# Altium project RMOV_chopper_ver1-0.PrjPcb (part 2 of 2)

## Sheet 02-MeasurementChannels.SchDoc
size C; DocumentNumber: 3; SheetNumber: 3; SheetTotal: 4
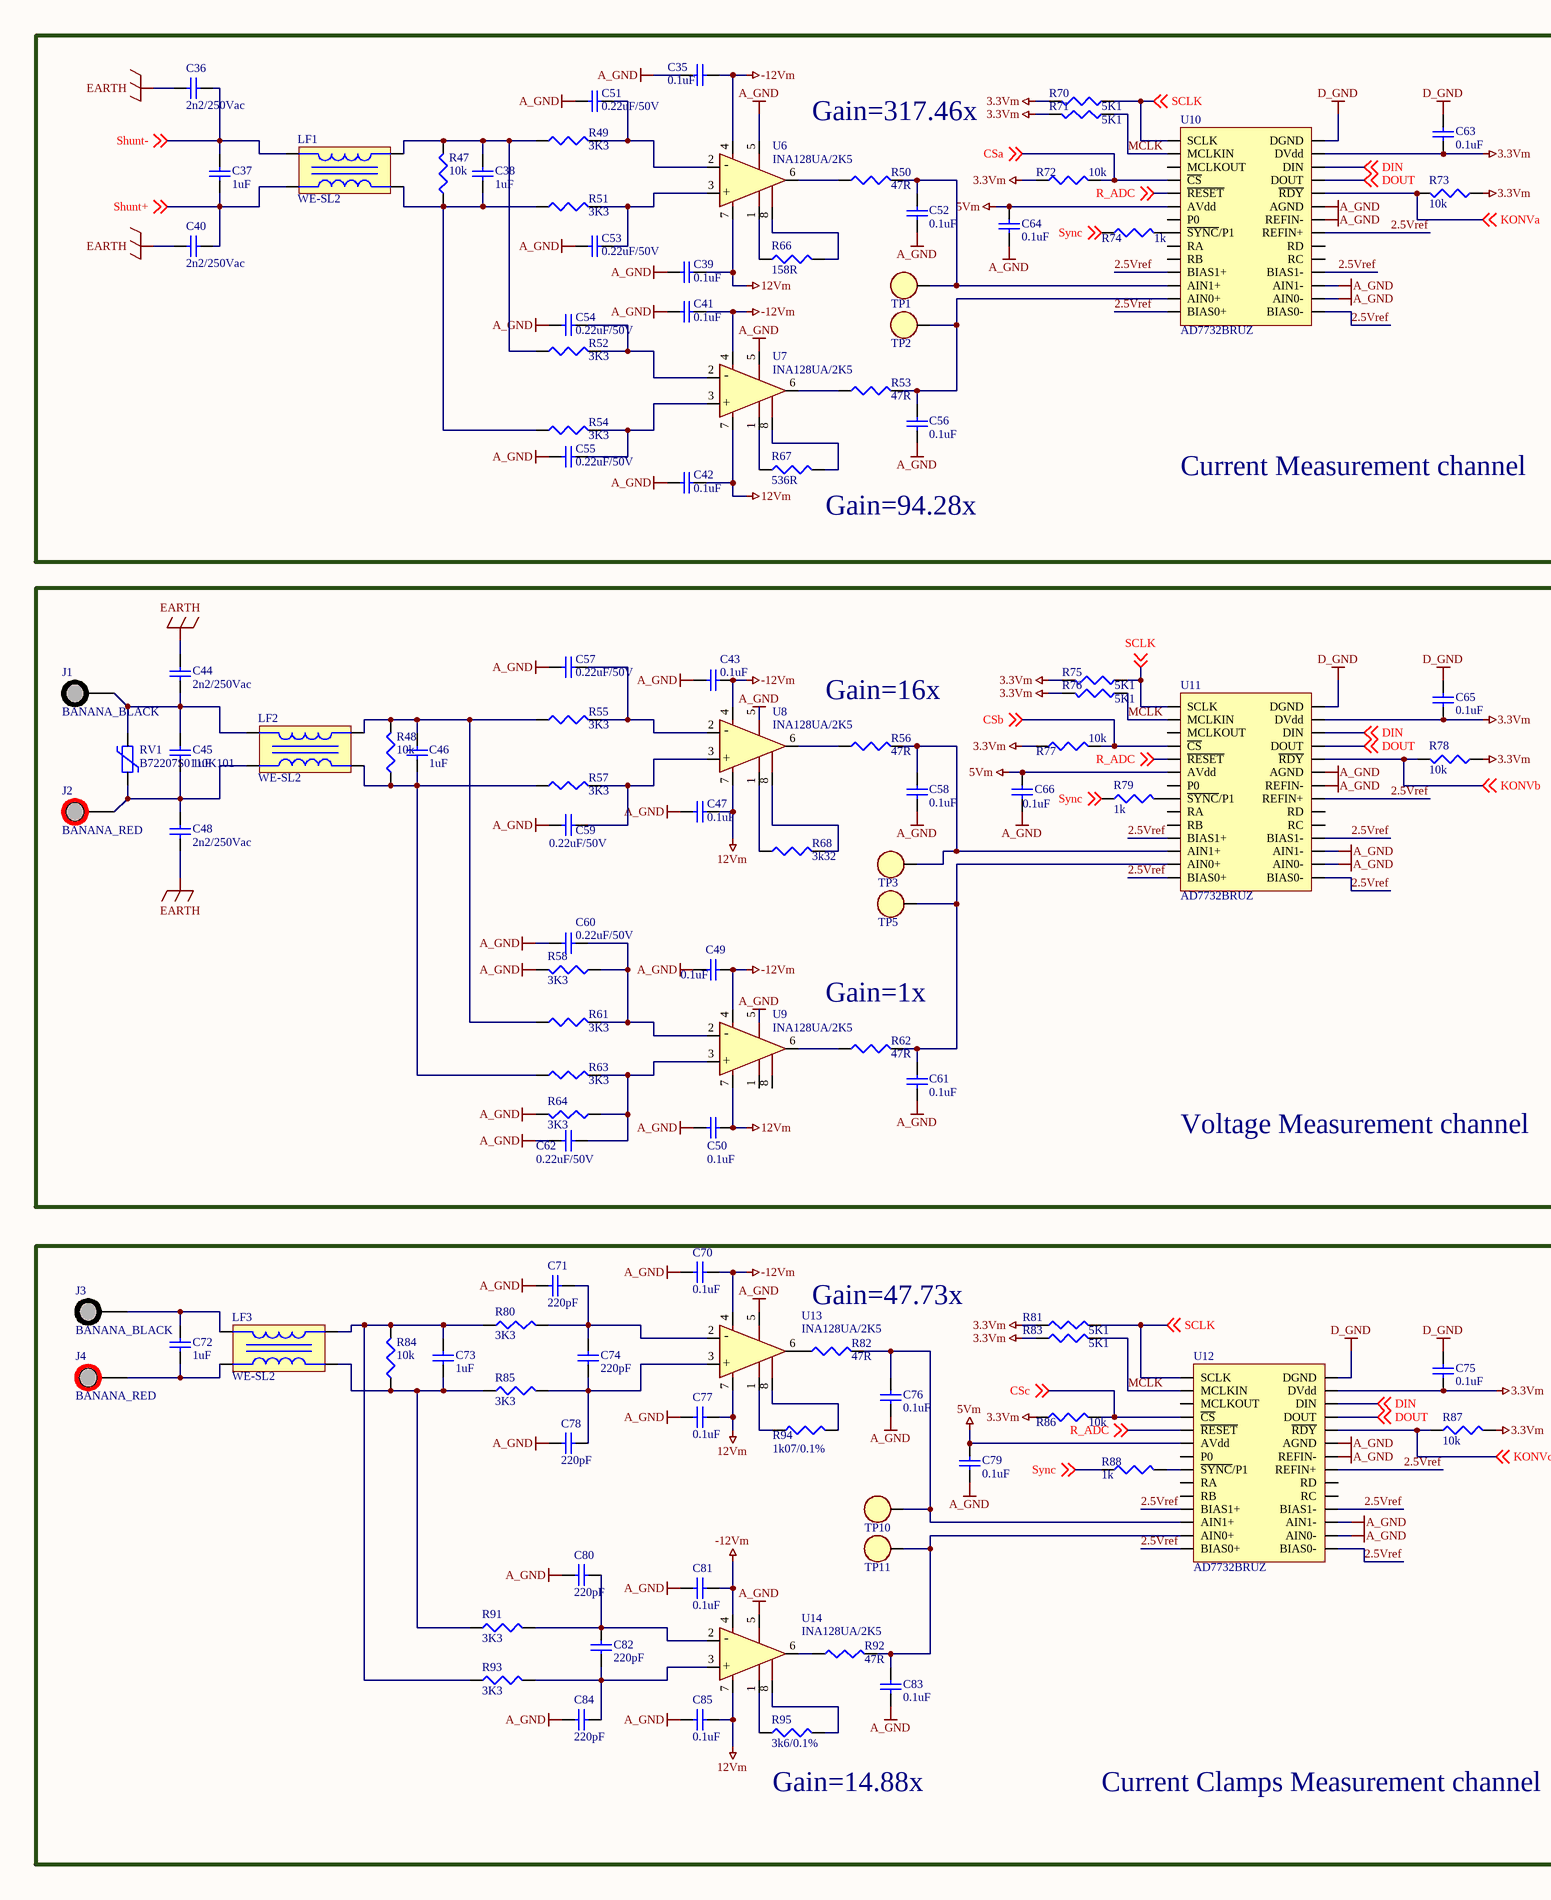
[diagram p2: 02-MeasurementChannels.SchDoc, left]
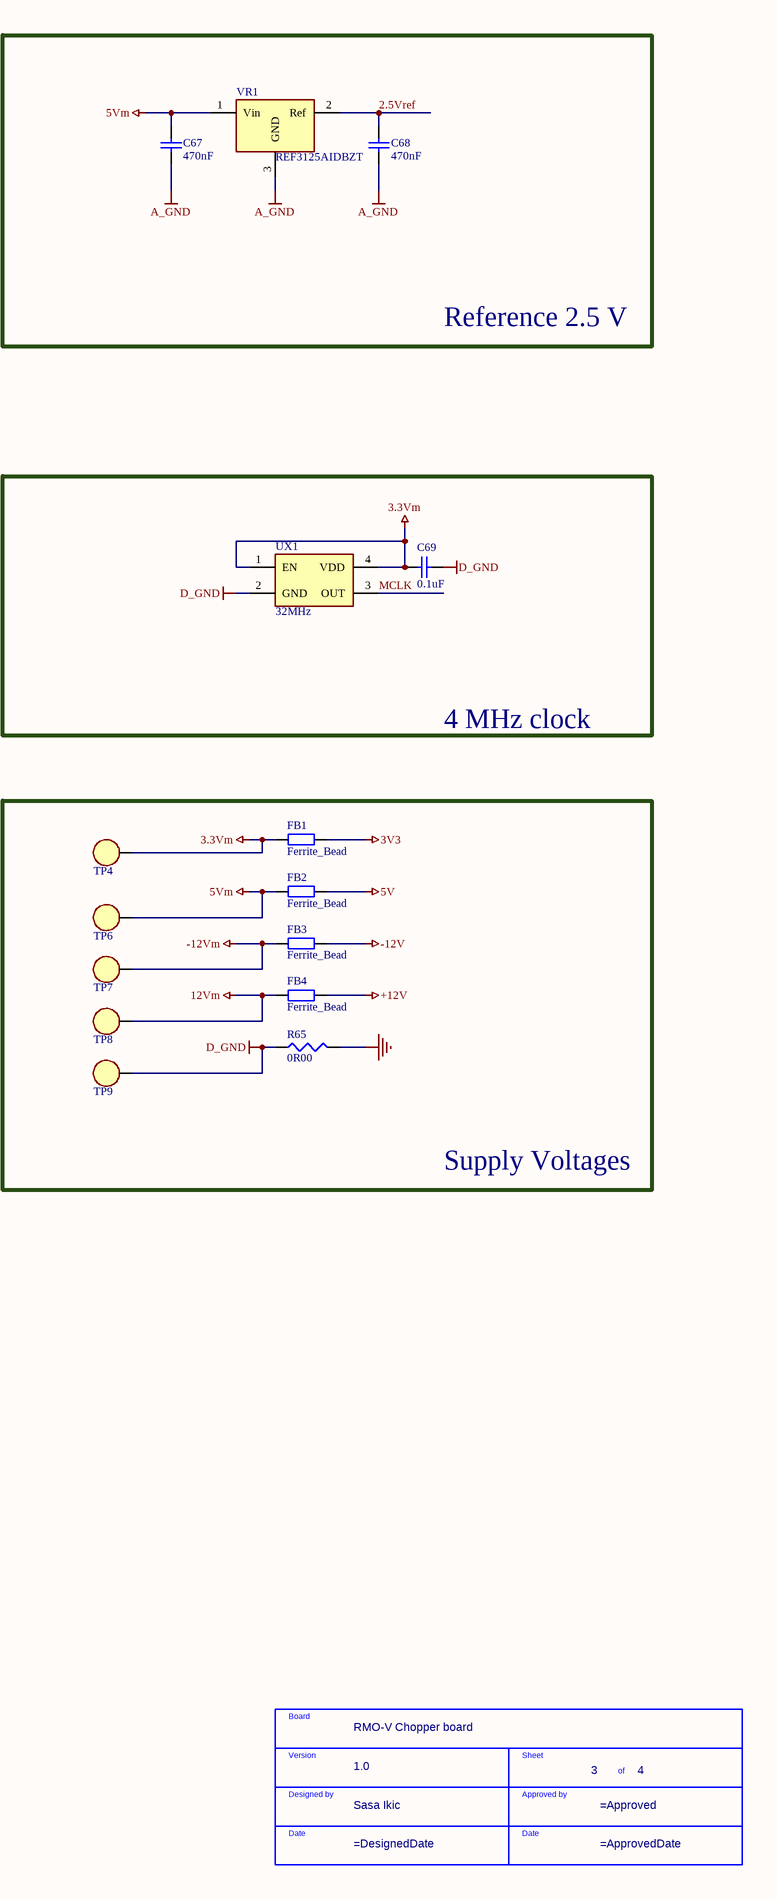
[diagram p3: 02-MeasurementChannels.SchDoc, right]

### Parts
(Parts that share a designator on the sheet are numbered #1, #2 ... from top to bottom, then left to right.)
C35  0.1uF  [C0805]
C36  2n2/250Vac  [CAPC3426X27N]
C37  1uF  [C0805]
C38  1uF  [C0805]
C39  0.1uF  [C0805]
C40  2n2/250Vac  [CAPC3426X27N]
C41  0.1uF  [C0805]
C42  0.1uF  [C0805]
C43  0.1uF  [C0805]
C44  2n2/250Vac  [CAPC3426X27N]
C45  1uF  [C0805]
C46  1uF  [C0805]
C47  0.1uF  [C0805]
C48  2n2/250Vac  [CAPC3426X27N]
C49  0.1uF  [C0805]
C50  0.1uF  [C0805]
C51  0.22uF/50V  [C0805]
C52  0.1uF  [C0805]
C53  0.22uF/50V  [C0805]
C54  0.22uF/50V  [C0805]
C55  0.22uF/50V  [C0805]
C56  0.1uF  [C0805]
C57  0.22uF/50V  [C0805]
C58  0.1uF  [C0805]
C59  0.22uF/50V  [C0805]
C60  0.22uF/50V  [C0805]
C61  0.1uF  [C0805]
C62  0.22uF/50V  [C0805]
C63  0.1uF  [C0805]
C64  0.1uF  [C0805]
C65  0.1uF  [C0805]
C66  0.1uF  [C0805]
C67  470nF  [C0805]
C68  470nF  [C0805]
C69  0.1uF  [C0805]
C70  0.1uF  [C0805]
C71  220pF  [C0805]
C72  1uF  [C0805]
C73  1uF  [C0805]
C74  220pF  [C0805]
C75  0.1uF  [C0805]
C76  0.1uF  [C0805]
C77  0.1uF  [C0805]
C78  220pF  [C0805]
C79  0.1uF  [C0805]
C80  220pF  [C0805]
C81  0.1uF  [C0805]
C82  220pF  [C0805]
C83  0.1uF  [C0805]
C84  220pF  [C0805]
C85  0.1uF  [C0805]
FB1  Ferrite_Bead  [FB0805]
FB2  Ferrite_Bead  [FB0805]
FB3  Ferrite_Bead  [FB0805]
FB4  Ferrite_Bead  [FB0805]
J1  BANANA_BLACK  [BANANA_THT_BLACK]
J2  BANANA_RED  [BANANA_THT_RED]
J3  BANANA_BLACK  [BANANA_THT_BLACK]
J4  BANANA_RED  [BANANA_THT_RED]
LF1  WE-SL2  [SOJ254P940X500-4M]
LF2  WE-SL2  [SOJ254P940X500-4M]
LF3  WE-SL2  [SOJ254P940X500-4M]
R47  10k  [R0805]
R48  10k  [R0805]
R49  3K3  [R0805]
R50  47R  [R0805]
R51  3K3  [R0805]
R52  3K3  [R0805]
R53  47R  [R0805]
R54  3K3  [R0805]
R55  3K3  [R0805]
R56  47R  [R0805]
R57  3K3  [R0805]
R58  3K3  [R0805]
R61  3K3  [R0805]
R62  47R  [R0805]
R63  3K3  [R0805]
R64  3K3  [R0805]
R65  0R00  [R0805]
R66  158R  [R0805]
R67  536R  [R0805]
R68  3k32  [R0805]
R70  5K1  [R0805]
R71  5K1  [R0805]
R72  10k  [R0805]
R73  10k  [R0805]
R74  1k  [R0805]
R75  5K1  [R0805]
R76  5K1  [R0805]
R77  10k  [R0805]
R78  10k  [R0805]
R79  1k  [R0805]
R80  3K3  [R0805]
R81  5K1  [R0805]
R82  47R  [R0805]
R83  5K1  [R0805]
R84  10k  [R0805]
R85  3K3  [R0805]
R86  10k  [R0805]
R87  10k  [R0805]
R88  1k  [R0805]
R91  3K3  [R0805]
R92  47R  [R0805]
R93  3K3  [R0805]
R94  1k07/0.1%  [R0805]
R95  3k6/0.1%  [R0805]
RV1  B72207S0110K101  [S20K300]
STB#3  -  (value not drawn)  (graphical)
TP1  -  [TESTPOINT_0.8X1.5]  (value not drawn)  (no BOM)
TP2  -  [TESTPOINT_0.8X1.5]  (value not drawn)  (no BOM)
TP3  -  [TESTPOINT_0.8X1.5]  (value not drawn)  (no BOM)
TP4  -  [TESTPOINT_0.8X1.5]  (value not drawn)  (no BOM)
TP5  -  [TESTPOINT_0.8X1.5]  (value not drawn)  (no BOM)
TP6  -  [TESTPOINT_0.8X1.5]  (value not drawn)  (no BOM)
TP7  -  [TESTPOINT_0.8X1.5]  (value not drawn)  (no BOM)
TP8  -  [TESTPOINT_0.8X1.5]  (value not drawn)  (no BOM)
TP9  -  [TESTPOINT_0.8X1.5]  (value not drawn)  (no BOM)
TP10  -  [TESTPOINT_0.8X1.5]  (value not drawn)  (no BOM)
TP11  -  [TESTPOINT_0.8X1.5]  (value not drawn)  (no BOM)
U6  INA128UA/2K5  [SOIC8]
U7  INA128UA/2K5  [SOIC8]
U8  INA128UA/2K5  [SOIC8]
U9  INA128UA/2K5  [SOIC8]
U10  AD7732BRUZ  [TSOP65P640X120-28N]
U11  AD7732BRUZ  [TSOP65P640X120-28N]
U12  AD7732BRUZ  [TSOP65P640X120-28N]
U13  INA128UA/2K5  [SOIC8]
U14  INA128UA/2K5  [SOIC8]
UX1  32MHz  [DFN4]
VR1  REF3125AIDBZT  [SOT23_123]

### Blocks framed on the sheet
Reference 2.5 V: C67 C68 VR1
4 MHz clock: C69 UX1
Supply Voltages: FB1-FB4 R65 TP4 TP6-TP9

### Nets
3.3Vm: C63.1 C65.1 C69.2 C75.1 FB1.1 R70.2 R71.2 R72.1 R73.1 R75.2 R76.2 R77.1 R78.1 R81.1 R83.1 R86.1 R87.2 TP4.1 U10.27(DVdd) U11.27(DVdd) U12.27(DVdd) UX1.1(EN) UX1.4(VDD)
3V3: FB1.2
5V: FB2.2
5Vm: C64.2 C66.2 C67.2 C79.2 FB2.1 TP6.1 U10.6(AVdd) U11.6(AVdd) U12.6(AVdd) VR1.1(Vin)
12Vm: C39.2 C42.2 C47.2 C50.2 C77.1 C85.1 FB4.1 TP8.1 U6.7(+V) U7.7(+V) U8.7(+V) U9.7(+V) U13.7(+V) U14.7(+V)
+12V: FB4.2
-12V: FB3.2
-12Vm: C35.2 C41.2 C43.2 C49.2 C70.1 C81.1 FB3.1 TP7.1 U6.4(-V) U7.4(-V) U8.4(-V) U9.4(-V) U13.4(-V) U14.4(-V)
A_GND: C35.1 C39.1 C41.1 C42.1 C43.1 C47.1 C49.1 C50.1 C51.1 C52.1 C53.1 C54.1 C55.1 C56.1 C57.1 C58.1 C59.1 C60.1 C61.1 C62.1 C64.1 C66.1 C67.1 C68.1 C70.2 C71.2 C76.1 C77.2 C78.2 C79.1 C80.2 C81.2 C83.1 C84.2 C85.2 R58.2 R64.2 U6.5(REF) U7.5(REF) U8.5(REF) U9.5(REF) U10.16(AIN0-) U10.17(AIN1-) U10.22(REFIN-) U10.23(AGND) U11.16(AIN0-) U11.17(AIN1-) U11.22(REFIN-) U11.23(AGND) U12.16(AIN0-) U12.17(AIN1-) U12.22(REFIN-) U12.23(AGND) U13.5(REF) U14.5(REF) VR1.3(GND)
D_GND: C63.2 C65.2 C69.1 C75.2 R65.1 TP9.1 U10.28(DGND) U11.28(DGND) U12.28(DGND) UX1.2(GND)
EARTH: C36.2 C40.2 C44.2 C48.1
P_GND: R65.2
2.5Vref: C68.2 U10.11(BIAS1+) U10.14(BIAS0+) U10.15(BIAS0-) U10.18(BIAS1-) U10.21(REFIN+) U11.11(BIAS1+) U11.14(BIAS0+) U11.15(BIAS0-) U11.18(BIAS1-) U11.21(REFIN+) U12.11(BIAS1+) U12.14(BIAS0+) U12.15(BIAS0-) U12.18(BIAS1-) U12.21(REFIN+) VR1.2(Ref)
CSa: R72.2 U10.4(~{CS}) ; off-sheet CSa
CSb: R77.2 U11.4(~{CS}) ; off-sheet CSb
CSc: R86.2 U12.4(~{CS}) ; off-sheet CSc
DIN: U10.26(DIN) U11.26(DIN) U12.26(DIN) ; off-sheet DIN
DOUT: U10.25(DOUT) U11.25(DOUT) U12.25(DOUT) ; off-sheet DOUT
KONVa: R73.2 U10.24(~{RDY}) ; off-sheet KONVa
KONVb: R78.2 U11.24(~{RDY}) ; off-sheet KONVb
KONVc: R87.1 U12.24(~{RDY}) ; off-sheet KONVc
MCLK: R71.1 R76.1 R83.2 U10.2(MCLKIN) U11.2(MCLKIN) U12.2(MCLKIN) UX1.3(OUT)
R_ADC: U10.5(~{RESET}) U11.5(~{RESET}) U12.5(~{RESET}) ; off-sheet R_ADC
SCLK: R70.1 R75.1 R81.2 U10.1(SCLK) U11.1(SCLK) U12.1(SCLK) ; off-sheet SCLK
Shunt+: C37.1 C40.1 LF1.2 ; off-sheet Shunt+
Shunt-: C36.1 C37.2 LF1.1 ; off-sheet Shunt-
Sync: R74.1 R79.1 R88.1 ; off-sheet Sync
NetC38_1: C38.1 LF1.3 R47.1 R51.1 R54.1
NetC38_2: C38.2 LF1.4 R47.2 R49.1 R52.1
NetC44_1: C44.1 C45.2 J1.1 LF2.1 RV1.2
NetC45_1: C45.1 C48.2 J2.1 LF2.2 RV1.1
NetC46_1: C46.1 LF2.3 R48.1 R57.1 R63.1
NetC46_2: C46.2 LF2.4 R48.2 R55.1 R61.1
NetC51_2: C51.2 R49.2 U6.2(VIN-)
NetC52_2: C52.2 R50.2 TP1.1 U10.12(AIN1+)
NetC53_2: C53.2 R51.2 U6.3(Vin+)
NetC54_2: C54.2 R52.2 U7.2(VIN-)
NetC55_2: C55.2 R54.2 U7.3(Vin+)
NetC56_2: C56.2 R53.2 TP2.1 U10.13(AIN0+)
NetC57_2: C57.2 R55.2 U8.2(VIN-)
NetC58_2: C58.2 R56.2 TP3.1 U11.12(AIN1+)
NetC59_2: C59.2 R57.2 U8.3(Vin+)
NetC60_2: C60.2 R58.1 R61.2 U9.2(VIN-)
NetC61_2: C61.2 R62.2 TP5.1 U11.13(AIN0+)
NetC62_2: C62.2 R63.2 R64.1 U9.3(Vin+)
NetC71_1: C71.1 C74.2 R80.2 U13.2(VIN-)
NetC72_1: C72.1 J4.1 LF3.2
NetC72_2: C72.2 J3.1 LF3.1
NetC73_1: C73.1 LF3.3 R84.1 R85.1 R91.1
NetC73_2: C73.2 LF3.4 R80.1 R84.2 R93.1
NetC74_1: C74.1 C78.1 R85.2 U13.3(Vin+)
NetC76_2: C76.2 R82.2 TP10.1 U12.12(AIN1+)
NetC80_1: C80.1 C82.2 R91.2 U14.2(VIN-)
NetC82_1: C82.1 C84.1 R93.2 U14.3(Vin+)
NetC83_2: C83.2 R92.2 TP11.1 U12.13(AIN0+)
NetR50_1: R50.1 U6.6(Vout)
NetR53_1: R53.1 U7.6(Vout)
NetR56_1: R56.1 U8.6(Vout)
NetR62_1: R62.1 U9.6(Vout)
NetR66_1: R66.1 U6.1(RG)
NetR66_2: R66.2 U6.8(RG)
NetR67_1: R67.1 U7.1(RG)
NetR67_2: R67.2 U7.8(RG)
NetR68_1: R68.1 U8.1(RG)
NetR68_2: R68.2 U8.8(RG)
NetR74_2: R74.2 U10.8(~{SYNC}/P1)
NetR79_2: R79.2 U11.8(~{SYNC}/P1)
NetR82_1: R82.1 U13.6(Vout)
NetR88_2: R88.2 U12.8(~{SYNC}/P1)
NetR92_1: R92.1 U14.6(Vout)
NetR94_1: R94.1 U13.1(RG)
NetR94_2: R94.2 U13.8(RG)
NetR95_1: R95.1 U14.1(RG)
NetR95_2: R95.2 U14.8(RG)

Not connected (* = marked no-connect by the designer): U9 1(RG) 8(RG); U10 3(MCLKOUT) 7(P0) 9(RA) 10(RB) 19(RC) 20(RD); U11 3(MCLKOUT) 7(P0) 9(RA) 10(RB) 19(RC) 20(RD); U12 3(MCLKOUT) 7(P0) 9(RA) 10(RB) 19(RC) 20(RD)

### Notes on the sheet
- Gain=317.46x
- Current Measurement channel
- (near R67) Gain=94.28x
- Gain=16x
- Gain=1x
- Voltage Measurement channel
- Gain=47.73x
- (near R95) Gain=14.88x
- Current Clamps Measurement channel
- (in symbol INA128UA/2K5) -; +
- (in symbol Schematic Title Block) Board; Version; Sheet; of; Designed by; Approved by; Date

### Library data of the parts
C35 C39 C41-C43 C47 C49 C50 C52 C56 C58 C61 C63-C66 C69 C70 C75-C77 C79 C81 C83 C85 = 08055C104KAT2A: CAP 0.1uF 0805 50V; Manufacturer: KEMET; Ceramic Capacitor Case: 0805 [2012 Metric]; Capacitance: 0.1; Voltage Rating: 50; Capacitance Tolerance: ± 10%; Dielectric Characteristic: X7; SVHC: No SVHC (17-Dec-2015); Capacitance Tolerance +: 10%; Capacitor Terminals: SMD; External Depth: 0.95; External Length / Height: 2; External Width: 1.25; Insulation Resistance: 100000; Reel Quantity: 3000; Voltage Rating V DC: 50V<!--FANDB--><div class="features-and-benefits-container"><div class="features-and-benefits-description"><span class="features-benefits-value">The AVX multilayer ceramic capacitors with EIA class II, X7R dielectric material are temperature stable ceramic chip capacitors. This multilayer ceramic capacitor is a monolithic block of ceramic containing two sets of offset, interleaved planar electrodes that extend to two opposite surfaces of ceramic dielectric. Capacitance for X7R dielectric varies under influence of electrical operating conditions such as voltage and frequency. X7R dielectric chip usage covers broad spectrum of industrial applications where known changes in capacitance due to applied voltages are acceptable.</span></div><div class="features-and-benefits-list"><ul class="features-and-benefits-list-list"><li class="features-and-benefits-list-item">Capacitance value ranges from 100pF to 100?F</li><li class="features-and-benefits-list-item">EIA 0101, 0201, 0402, 0603, 0805, 1206, 1210, 1812, 1825, 2220, 2225 case sizes available</li><li class="features-and-benefits-list-item">Rated DC voltage of 4V, 6.3V, 10V, 16V, 25V, 50V, 100V, 200V, 500V</li><li class="features-and-benefits-list-item">±5%, ±10% and ±20% tolerance</li><li class="features-and-benefits-list-item">Available in FLEXITERM/gold/Nickel (Ni) and tin (Sn) plated terminations</li><li class="features-and-benefits-list-item">Load life of 1000h at 125?C</li><li class="features-and-benefits-list-item">Operating temperature range from -55?C to 125; .PCBChecked: BP; Supplier 1: Avnet Abacus; Manufacturer Part Number: 08055C104KAT2A; RoHS: YES; Stock 1: 94357; Pricing 1: 10=0.0194, 100=0.0134, 500=0.0106, 1000=0.0088, 2000=0.0075 (GBP); Product Range: -; Packaging: Cut Tape; Operating Temperature Min: -55; Operating Temperature Max: 125; Automotive Qualification Standard: -; MSL: MSL 1 - Unlimited; Capacitance Tolerance ±: ± 10%; No. of Pins: 2; Operating Temperature Range: -55°C to +125; Tape Width: 8; Tolerance +: 10%; Tolerance -: 10%; ComponentLink1URL: http://www.farnell.com/datasheets/2237835.pdf; ComponentLink1Description: Datasheet; Supplier Part Number 1: C0805C104K5RAC7800; Category: Capacitors; Package: CAPC2012X88N; Type: SMD; .SCHChecked: BP
C36 C40 C44 C48 = GA355QR7GF222KW01L: Cap Ceramic 0.0022uF 250VAC X7R 10% SMD 2220 Embossed T/R; Manufacturer: Murata; Manufacturer Part Number: GA355QR7GF222KW01L; Package: CAPC5750X180N; Category: Capasitor; Max Rated Voltage: 250 Vac; Dielectric Characteristic: X7R; Type: SMD; Supplier1: Avnet; Supplier part number: GA355QR7GF222KW01L; Tolerance: 10%; ComponentLink1Description: Datasheet; ComponentLink1URL: https://eu.mouser.com/datasheet/2/281/murata_07092018_C02E_GA3-1379931.pdf
C37 C38 C45 C46 C72 C73 = C0805C105K3RACTU: CAP 1UF 0805 25V; Manufacturer: KEMET; Capacitance: 1µF; Tolerance: ±10%; Temperature Coefficient: X7R; Type: SMD; .PCBChecked: BP; Supplier 1: Avnet Abacus; Manufacturer Part Number: C0805C105K3RACTU; RoHS: RoHS Compliant; Category: Capacitors; Stock 1: 215000; Pricing 1: 2500=0.0189, 5000=0.01739, 12500=0.01512, 25000=0.01436, 62500=0.01285, 125000=0.0104 (USD); Packaging: Tape & Reel (TR); Part Status: Active; Voltage - Rated: 25V; Operating Temperature: -55°C ~ 125°C; Features: Low ESL; Ratings: -; Applications: General Purpose; Failure Rate: -; Mounting Type: Surface Mount, MLCC; Package: CAPC2012X88N; Size / Dimension: 0.079" L x 0.049" W (2.00mm x 1.25mm); Height - Seated (Max): -; Thickness (Max): 0.055" (1.40mm); Lead Spacing: -; Lead Style: -; ComponentLink1URL: http://www.kemet.com/docfinder?Partnumber=C0805C105K3RACTU; ComponentLink1Description: Datasheet; Supplier Part Number 1: C0805C105K3RACTU; .SCHChecked: BP
C51 C53-C55 C57 C59 C60 C62 = C0805C224K5RAC7800: Cap Ceramic 0.22uF 50V X7R 10% SMD 0805 125°C Paper T/R; Manufacturer: KEMET; Manufacturer Part Number: C0805C224K5RAC7800; Package: CAPC2012X88N; Category: Capasitor; Max Rated Voltage: 50 V; Temperature coefficient: X7R; Type: SMD; Supplier1: Avnet abacus; Supplier part number: C0805C224K5RAC7800; Tolerance: 10%; ComponentLink1Description: Datasheet; ComponentLink1URL: https://4donline.ihs.com/images/VipMasterIC/IC/KEME/KEME-S-A0008991654/KEME-S-A0008991654-1.pdf?hkey=52A5661711E402568146F3353EA87419
C67 C68 = C0805C474K5RACTU: CAP 470nF 0805 50V; Manufacturer: KEMET; Part # Aliases: C0805C474K5RAC7800; Capacitance: 0.47 uF; Capacitance - pF: 470000 pF; Case Height: 1 mm; Dielectric: X7R; Case Length: 2 mm; Case Width: 1.2 mm; Class: Class 1; Tolerance: 10 %; Temperature Coefficient / Code: +/- 15 %; Type: SMD; Supplier 1: Avnet Abacus; Manufacturer Part Number: C0805C474K5RACTU; Stock 1: 95318; Pricing 1: 1=0.28, 10=0.193, 100=0.1092, 500=0.0771, 1000=0.0675 (USD); Brand: Kemet; Capacitance - nF: 470 nF; Case Code - in: 0805; Case Code - mm: 2012; Dimensions: 1.2 mm W x 2 mm L x 1 mm H; Factory Pack Quantity: 2500; Voltage Rating: 50 V; Product Category: Multilayer Ceramic Capacitors MLCC - SMD/SMT; RoHS: Details; Voltage Rating DC: 50 V; Minimum Operating Temperature: - 55 C; Maximum Operating Temperature: + 125 C; Product: General Type MLCCs; Operating Temperature Range: - 55 C to + 125 C; Package: CAPC2012X88N; Packaging: Reel; Series: C0805C; Termination Style: SMD/SMT; ComponentLink1URL: https://datasheet.ciiva.com/5411/kem-c1002-x7r-smd-5411451.pdf; ComponentLink1Description: Datasheet; Supplier Part Number 1: C0805C102K5RACTU
C71 C74 C78 C80 C82 C84 = C0805C221J5GAC-TU: CAP 220PF 0805 50V; Manufacturer: KEMET; Dielectric Material: Ceramic; Tolerance: 5%; Dielectric: C0G; Temperature Coefficient: 30ppm/°C; Dissipation Factor: 0.1%; Type: SMD; Supplier 1: Avnet; Manufacturer Part Number: C0805C221J5GAC-TU; Stock 1: 1553; Pricing 1: 1=0.0177, 40=0.0177, 100=0.0176, 200=0.0176, 500=0.0175 (USD); Mount: Surface Mount,PCB; Case/Package: 0805; Number of Pins: 2; Case Code (Metric): 2012; Case Code (Imperial): 0805; Contact Material: Tin; Min Operating Temperature: -55°C; Max Operating Temperature: 125°C; Capacitance: 220pF; Voltage Rating (DC): 50V; Packaging: Tape and Reel; Voltage: 50V; Termination: SMD/SMT; Voltage Rating: 50V; Package Quantity: 1; Length: 2mm; Height: 0.78mm; Depth: 1.25mm; Width: 0.049inch; Thickness: 0.035inch; Lead Pitch: 0.75mm; Radiation Hardening: No; Lead Free: Lead Free; REACH SVHC: No SVHC; ComponentLink1URL: https://datasheet.ciiva.com/5421/kem-c1003-c0g-smd-356956-5421295.pdf; ComponentLink1Description: Datasheet; Supplier Part Number 1: C0805C221J5GAC TU/BKN; Package: CAPC2012X88N
FB1-FB4 = 2508056017Y0: FERRITE 300mA 0805 0.35R; Manufacturer: FAIR-RITE; Type: SMD; .PCBChecked: BP; Supplier 1: Farnell; Manufacturer Part Number: 2508056017Y0; RoHS: YES; Stock 1: 44162; Pricing 1: 10=0.0967, 100=0.028, 500=0.02, 1000=0.0171, 2000=0.015, 4000=0.0133, 20000=0.01, 40000=0.0098 (GBP); ComponentLink1URL: http://www.farnell.com/datasheets/2020787.pdf; ComponentLink1Description: Datasheet; Supplier Part Number 1: 1651722; Category: Ferrites; Package: FBC2012X110N; .SCHChecked: BP; DCR: 0.35R
J1 J3 = 66.9040-21: BANANA SOCKET PCB 4MM R/A BLACK; Manufacturer: Multi-Contact; Voltage Rating: 1kV; Current Rating: 24A; Supplier 1: RSComponents; Manufacturer Part Number: 66.9040-21; Stock 1: 0; Mount: Socket; Color: Black; Contact Material: Brass; Contact Plating: Gold; Termination: Solder; Voltage Rating (DC): 1kV; Length: 33mm; REACH SVHC: No SVHC; ComponentLink1URL: http://uk.rs-online.com/webdocs/1151/0900766b811511cc.pdf; ComponentLink1Description: Datasheet; Supplier Part Number 1: 7632998; Type: THT
J2 J4 = 66.9040-22: BANANA 66.9040-22 SOCKET PCB 4MM R/A RED; Manufacturer: Multi-Contact; Voltage Rating: 1kV; Current Rating: 24A; Supplier 1: RSComponents; Manufacturer Part Number: 66.9040-22; Stock 1: 0; Mount: Socket; Contact Material: Brass; Contact Plating: Gold; Color: Red; Termination: Solder; Voltage Rating (DC): 1kV; Length: 33mm; REACH SVHC: No SVHC; ComponentLink2URL: http://uk.rs-online.com/webdocs/1151/0900766b811511cc.pdf; ComponentLink2Description: Datasheet; Supplier Part Number 1: 7633001; Type: THT
LF1-LF3 = WE-SL2: 6.5mH @ 10kHz 2 Line Common Mode Choke Surface Mount 18.4 kOhms @ 700kHz 400mA DCR 950mOhm; Manufacturer: Würth Elektronik; Manufacturer Part Number: 744229; Max DC Voltage: 80 V; Package: SOL254P920X530-4N; Category: Line fitler; Max DC Current: 400 mA; DC resistance: 950 mOhm; Type: SMD; Supplier1: Wurth Elektronik; Supplier part number: 744-229; ComponentLink1Description: Datasheet; ComponentLink1URL: https://www.we-online.de/katalog/datasheet/744229.pdf
R47 R48 R72 R73 R77 R78 R84 R86 R87 = CRCW080510K0FKEA: RES 10K 0805 0.125W 1%; Manufacturer: Vishay Dale; Power (Watts): 0.125W, 1/8W; Temperature Coefficient: ±100ppm/°C; .PCBChecked: BP; Supplier 1: Future Electronics; Manufacturer Part Number: CRCW080510K0FKEA; RoHS: RoHS Compliant; Category: Resistors; Stock 1: 0; Pricing 1: 1=0.1, 10=0.042, 25=0.0304, 50=0.0232, 100=0.017, 250=0.013, 500=0.0104, 1000=0.00765 (USD); Packaging: Cut Tape (CT); Part Status: Active; Resistance (Ohms): 10k; Tolerance: ±1%; Composition: Thick Film; Features: Automotive AEC-Q200; Operating Temperature: -55°C ~ 155°C; Package: RESC2012X60N; Supplier Device Package: 0805; Size / Dimension: 0.079" L x 0.049" W (2.00mm x 1.25mm); Height - Seated (Max): 0.020" (0.50mm); Failure Rate: -; ComponentLink1URL: http://www.vishay.com/docs/20035/dcrcwe3.pdf; ComponentLink1Description: Datasheet; Supplier Part Number 1: CRCW080510K0FKEA; Type: SMD; .SCHChecked: BP
R49 R51 R52 R54 R55 R57 R58 R61 R63 R64 R80 R85 R91 R93 = RC0805FR-073K3L: RES 3K3 SMD 0805; Manufacturer: Yageo; Tolerance: 1%; Resistance: 3.3kR; Temperature Coefficient: 100ppm/°C; Power Rating: 125mW; Voltage Rating: 150V; Supplier 1: Future Electronics; Manufacturer Part Number: RC0805FR-073K3L; Stock 1: 0; Package: RESC2012X60N; Weight: 0.000194oz; Case Code (Metric): 2012; Case Code (Imperial): 0805; Min Operating Temperature: -55°C; Max Operating Temperature: 155°C; Packaging: Tape and Reel; Composition: Thick Film; Package Quantity: 1; Number of Terminations: 2; Termination: SMD/SMT; Max Power Dissipation: 125mW; Features: Moisture Resistant; Length: 2mm; Height: 0.5mm; Width: 0.049inch; Depth: 1.25mm; REACH SVHC: No SVHC; Lead Free: Lead Free; ComponentLink2URL: http://www.farnell.com/datasheets/444164.pdf; ComponentLink2Description: Datasheet; Supplier Part Number 1: 3186582; Type: SMD
R50 R53 R56 R62 = RC0805FR-0747RL: RC Series 0805 0.125 W 47 Ohm ±1% ±100 ppm/°C SMT Thick Film Chip Resistor; Manufacturer: Yageo; Power rating: 0.125W; Resistance: 24R; Manufacturer Part Number: RC0805FR-0747RL; Package: RESC1608X50N; Category: Resistor; Tolerance: 1%; Number of pins: 2; Type: SMD; Supplier1: Future electronics; Supplier part number: RC0805FR-0747RL; ComponentLink1Description: Datasheet; ComponentLink1URL: https://www.yageo.com/upload/media/product/productsearch/datasheet/rchip/PYu-RC_Group_51_RoHS_L_10.pdf
R65 = RC0805FR-070RL: Res Thick Film 0805 0 Ohm Jumper Molded SMD Paper T/R; Manufacturer: Yageo; Power rating: 0.125 W; Tolerance: 1%; Manufacturer Part Number: RC0805FR-070RL; Package: RESC2012X60N; Category: Resistor; Resistance: 0R00; Number of pins: 2; Type: SMD; Supplier1: Avnet abacus; Supplier part number: RC0805FR-070RL; ComponentLink1Description: Datasheet; ComponentLink1URL: https://www.yageo.com/documents/recent/PYu-RC_Group_51_RoHS_L_2.pdf
R66 = RP73D2A158RBTG: RP73D2A158RBTG -  SMD Chip Resistor, 0805 [2012 Metric], 158 ohm, RP73 Series, 150 V, Thin Film, 125 mW; Manufacturer: TE CONNECTIVITY; Power rating: 0.125 W; Tolerance: 0.1%; Manufacturer Part Number: RP73D2A158RBTG; Package: RESC2012X60N; Category: Resistor; Resistance: 158R; Number of pins: 2; Type: SMD; Supplier1: Farnell; Supplier part number: 1502085; ComponentLink1Description: Datasheet; ComponentLink1URL: http://www.farnell.com/datasheets/1635325.pdf?_ga=2.186296809.1345311335.1582205552-437978810.1505463394
R67 = RN73C2A536RBTDF: RN73C2A536RBTDF -  SMD Chip Resistor, Precision, 0805 [2012 Metric], 536 ohm, RN73 Series, 100 V, Thin Film, 100 mW; Manufacturer: TE CONNECTIVITY; Power rating: 0.1 W; Tolerance: 0.1%; Manufacturer Part Number: RN73C2A536RBTDF; Package: RESC2012X60N; Category: Resistor; Resistance: 536R; Number of pins: 2; Type: SMD; Supplier1: Farnell; Supplier part number: 2613710; ComponentLink1Description: Datasheet; ComponentLink1URL: http://www.farnell.com/datasheets/2095297.pdf?_ga=2.177867877.1345311335.1582205552-437978810.1505463394
R68 = ERA6AEB3321V: ERA6AEB3321V - SMD Resistor, Metal Thin Film 3.32 kOhm, ± 0.1 %, Panasonic; Power rating: 0.125 W; Tolerance: 0.1%; Manufacturer: Panasonic; Manufacturer Part Number: ERA6AEB3321V; Package: RESC2012X60N; Category: Resistor; Resistance: 3k32; Number of pins: 2; Type: SMD; Supplier1: Elfa; Supplier part number: 300-37-513; ComponentLink1Description: Datasheet; ComponentLink1URL: https://www.elfa.se/Web/Downloads/_t/ds/ERA-series_eng_tds.pdf?pid=30037513
R70 R71 R75 R76 R81 R83 = CRCW08055K10FKEA: RES 5K1 0805 0.125W 1%; Manufacturer: Vishay; Brand: Vishay / Dale; Resistance: 5.1 kOhms; Power Rating: 125 mW (1/8 W); Temperature Coefficient: 100 PPM / K; Voltage Rating: 150 V; Case Height: 0.45 mm; Case Length: 2 mm; Case Width: 1.25 mm; Unit Weight: 0.000194 oz; Supplier 1: Avnet Abacus; Manufacturer Part Number: CRCW08055K10FKEA; Stock 1: 58545; Pricing 1: 1=0.1, 10=0.055, 100=0.0223, 1000=0.01, 2500=0.0087 (USD); Product Category: Thick Film Resistors - SMD; RoHS: Details; Tolerance: 1 %; Case Code - in: 0805; Case Code - mm: 2012; Operating Temperature Range: - 55 C to + 155 C; Package: RESC2012X60N; Packaging: Reel; Product: Thick Film Resistors SMD; Series: CRCW; Factory Pack Quantity: 5000; ComponentLink1URL: https://datasheet.ciiva.com/11810/0900766b80d98b26-11810353.pdf; ComponentLink1Description: Datasheet; Supplier Part Number 1: CRCW08055K10FKEA; Type: SMD
R74 R79 R88 = CRCW08051K00FKEA: RES 1K 0805 0.125W 1%; Manufacturer: Vishay Dale; Power (Watts): 0.125W, 1/8W; Temperature Coefficient: ±100ppm/°C; .PCBChecked: BP; Supplier 1: Avnet Abacus; Manufacturer Part Number: CRCW08051K00FKEA; RoHS: RoHS Compliant; Category: Resistors; Stock 1: 528553; Pricing 1: 1=0.1, 10=0.042, 25=0.0304, 50=0.0232, 100=0.017, 250=0.013, 500=0.0104, 1000=0.00765 (USD); Packaging: Cut Tape (CT); Part Status: Active; Resistance (Ohms): 1k; Tolerance: ±1%; Composition: Thick Film; Features: Automotive AEC-Q200; Operating Temperature: -55°C ~ 155°C; Package: RESC2012X60N; Supplier Device Package: 0805; Size / Dimension: 0.079" L x 0.049" W (2.00mm x 1.25mm); Height - Seated (Max): 0.020" (0.50mm); Failure Rate: -; ComponentLink1URL: http://www.vishay.com/docs/20035/dcrcwe3.pdf; ComponentLink1Description: Datasheet; Supplier Part Number 1: CRCW08051K00FKEA; Type: SMD; .SCHChecked: BP
R82 R92 = CRCW080547R0FKEA: RES 47R 0805 0.125W 1%; Manufacturer: Vishay; Power Rating: 125mW; Temperature Coefficient: 100ppm/°C; Voltage Rating: 150V; Supplier 1: Avnet; Manufacturer Part Number: CRCW080547R0FKEA; Stock 1: 220000; Pricing 1: 5000=0.0071, 10000=0.007, 20000=0.007, 30000=0.007, 50000=0.005 (USD); Mount: Surface Mount; Package: RESC2012X60N; Weight: 0.000194oz; Case Code (Imperial): 0805; Case Code (Metric): 2012; Contact Plating: Tin; Min Operating Temperature: -55°C; Max Operating Temperature: 155°C; Resistance: 47R; Tolerance: 1%; Composition: Thick Film; Packaging: Tape and Reel; Package Quantity: 5000; Number of Terminations: 2; Type: SMD; Military Standard: Not; Max Power Dissipation: 125mW; Voltage Rating (DC): 150V; Length: 2mm; Height: 0.45mm; Width: 1.25mm; Depth: 1.25mm; Radiation Hardening: No; Lead Free: Lead Free; REACH SVHC: Unknown; ComponentLink1URL: https://datasheet.ciiva.com/11810/0900766b80d98b26-11810031.pdf; ComponentLink1Description: Datasheet; Supplier Part Number 1: CRCW080547R0FKEA
R94 = ERA6AEB1071V: ERA6AEB1071V -  SMD Chip Resistor, 0805 [2012 Metric], 1.07 kohm, ERA6A Series, 100 V, Thin Film, 125 mW; Manufacturer: Panasonic; Power rating: 0.125 W; Resistance: 1k07; Tolerance: 0.1%; Manufacturer Part Number: ERA6AEB1071V; Package: RESC2012X60N; Category: Resistor; Number of pins: 2; Type: SMD; Supplier1: Farnell; Supplier part number: 1810505; ComponentLink1Description: Datasheet; ComponentLink1URL: http://www.farnell.com/datasheets/2052875.pdf?_ga=2.42747878.2129382359.1582535833-437978810.1505463394
R95 = ERA6AEB362V: ERA6AEB362V - SMD Resistor, Metal Thin Film 3.6 kOhm, ± 0.1 %, Panasonic; Power rating: 0.125 W; Resistance: 3k6; Tolerance: 0.1%; Manufacturer: Panasonic; Manufacturer Part Number: ERA6AEB362V; Package: RESC2012X60N; Category: Resistor; Number of pins: 2; Type: SMD; Supplier1: Elfa; Supplier part number: 160-21-980; ComponentLink1Description: Datasheet; ComponentLink1URL: https://www.elfa.se/Web/Downloads/_t/ds/ERA-series_eng_tds.pdf?pid=16021980
RV1 = B72207S0110K101: VARISTOR 11VAC S20K300 250A; Manufacturer: TDK EPCOS; Varistor Type: Metal Oxide Varistor (MOV); Varistor Case Style: Disc 7mm; Clamping Voltage Vc Max: 36V; Peak Energy (10/1000uS): 800mJ; Voltage Rating V DC: 14V; Voltage Rating V AC: 11V; SVHC: No SVHC (16-Jun-2014); Supplier 1: Mouser; Manufacturer Part Number: B72207S0110K101; Stock 1: 6090; Pricing 1: 1=0.53, 10=0.306, 50=0.306, 100=0.178, 1000=0.111, 10000=0.086 (USD); Series: B722; Peak Surge Current @ 8/20µs: 250A; Operating Temperature Min: -40°C; Operating Temperature Max: 85°C; ComponentLink1URL: https://datasheet.ciiva.com/15155/getdatasheetpartid-151373-15155595.pdf; ComponentLink1Description: Datasheet; Supplier Part Number 1: 871-B72207S110K101; Type: THT; Package: Radial
STB#3 = Schematic Title Block: Schematic Title Block Template
TP1-TP11 = Testpoint: Testpoint 0.8mm X 1.5mm; .PCBChecked: BP; .SCHChecked: BP
U6-U9 U13 U14 = INA128UA/2K5: INA128 OP AMP 1.3MHZ SGL 8SOIC; Manufacturer: Texas Instruments; Nominal Supply Current: 750uA; Number of Channels: 1; Quiescent Current: 700uA; Slew Rate: 4V/µs; Min Dual Supply Voltage: 2.25V; Max Dual Supply Voltage: 18V; Dual Supply Voltage: 15V; Common Mode Rejection Ratio: 110dB; Max Supply Voltage: 36V; Min Supply Voltage: 4.5V; Input Offset Voltage (Vos): 125uV; Input Bias Current: 10nA; Input Voltage Noise Density: 8nV/sqrt Hz; Number of Elements: 3; Voltage Gain: 80dB; Input Resistance: 100GR; Supplier 1: EBV Elektronik; Manufacturer Part Number: INA128UA/2K5; Stock 1: 10466; Pricing 1: 1=7.36, 10=6.65, 100=5.5057, 500=4.7943, 1000=4.1757 (USD); Case/Package: D; Number of Pins: 8; Weight: 0.002677oz; Min Operating Temperature: -40°C; Max Operating Temperature: 125°C; Packaging: Tape and Reel; Number of Circuits: 1; Bandwidth: 1.3MHz; Package Quantity: 2500; Gain Bandwidth Product: 1.3MHz; Number of Amplifiers: 3; Radiation Hardening: No; Lead Free: Lead Free; REACH SVHC: No SVHC; ComponentLink1URL: https://datasheet.ciiva.com/15128/getdatasheetpartid-223550-15128534.pdf; ComponentLink1Description: Datasheet; Supplier Part Number 1: INA128UA/2K5; Type: SMD; Package: SOIC127P600X175-8N
U10-U12 = AD7732BRUZ: 24 Bit Analog to Digital Converter 2 Input 1 Sigma-Delta 28-TSSOP; Number of Inputs: 2; Input Type: Diferential; Data Interface: SPI, DSP; Number of A/D Converters: 1; Voltage - Supply, Analog: 5 V; Voltage - Supply, Digital: 2.7V ~ 3.6V, 5V; Number of bits: 24; Sampling Rate (Per Second): 15.4k; ComponentLink1Description: Datasheet; ComponentLink1URL: https://www.analog.com/media/en/technical-documentation/data-sheets/AD7732.pdf; Category: Data Acquisition - Analog to Digital Converters (ADC); Architecture: Sigma-Delta; Operating Temperature: -40°C ~ 105°C; Case: 28-TSSOP (0.173", 4.40mm Width); Package: SOP65P640X120-28N; Manufacturer Part Number: AD7732BRUZ; Supplier: Sangus; Parameter 2: *
UX1 = 7W-32.000MBB-T: OSC 32MHZ DFN4 3V3; Manufacturer: TXC; Catalog Drawings: 7(W,C,X), 8W Series Bottom / 7W Series Side / 7W Series Top; Function: Tri-State (Output Enable); Output: CMOS; Voltage - Supply: 3.3V; Frequency Stability: ±50ppm; Current - Supply (Max): 20mA; Dynamic Catalog: 7W Series; Other Names: 887-1177-2; Manufacturer Part Number: 7W-32.000MBB-T; Standard Package: 1,000; Category: Crystals and Oscillators; Family: Oscillators; Series: 7W; Type: SMD; Frequency: 32MHz; Operating Temperature: -10°C ~ 70°C; Mounting Type: Surface Mount; Size / Dimension: 0.276" L x 0.197" W (7.00mm x 5.00mm); Height: 0.056" (1.42mm); Package: DFN720X520X140-4N; Packaging: Tape & Reel (TR); ComponentLink1URL: https://datasheet.ciiva.com/866/7w-866142.pdf; ComponentLink1Description: Datasheet; Supplier 1: Mouser; Supplier Part Number 1: 717-7W-32.000MBB-T
VR1 = REF3125AIDBZT: VREF 2.5V SOT23-123; Manufacturer: Texas Instruments; Output Current: 10mA; Temperature Coefficient: 20ppm/°C; Quiescent Current: 100uA; Min Input Voltage: 2.55V; Max Input Voltage: 5.5V; Tolerance: 0.2%; Operating Supply Current: 135uA; Reference Type: Series,Fixed; Supplier 1: Digi-Key; Manufacturer Part Number: REF3125AIDBZT; Stock 1: 5110; Pricing 1: 1=2.73, 10=2.456, 100=2.0125 (USD); Case/Package: SOT-23; Number of Pins: 3; Weight: 0.050717oz; Min Operating Temperature: -40°C; Max Operating Temperature: 125°C; Packaging: Tape and Reel; Output Voltage: 2.5V; Package Quantity: 1; Min Output Voltage: 2.5V; Max Supply Current: 100uA; Reference Voltage: 2.5V; Max Output Voltage: 2.5V; Max Output Current: 10mA; Termination: SMD/SMT; Length: 2.92mm; Height: 1mm; Width: 1.3mm; Radiation Hardening: No; REACH SVHC: No SVHC; Lead Free: Lead Free; ComponentLink1URL: https://datasheet.ciiva.com/27052/1369168-27052113.pdf; ComponentLink1Description: Datasheet; Supplier Part Number 1: 296-17509-1-ND; Type: SMD; Package: SOT95P245X110-3N

## Sheet 03-Connectors.SchDoc
size A; DocumentNumber: 4; SheetNumber: 4; SheetTotal: 4
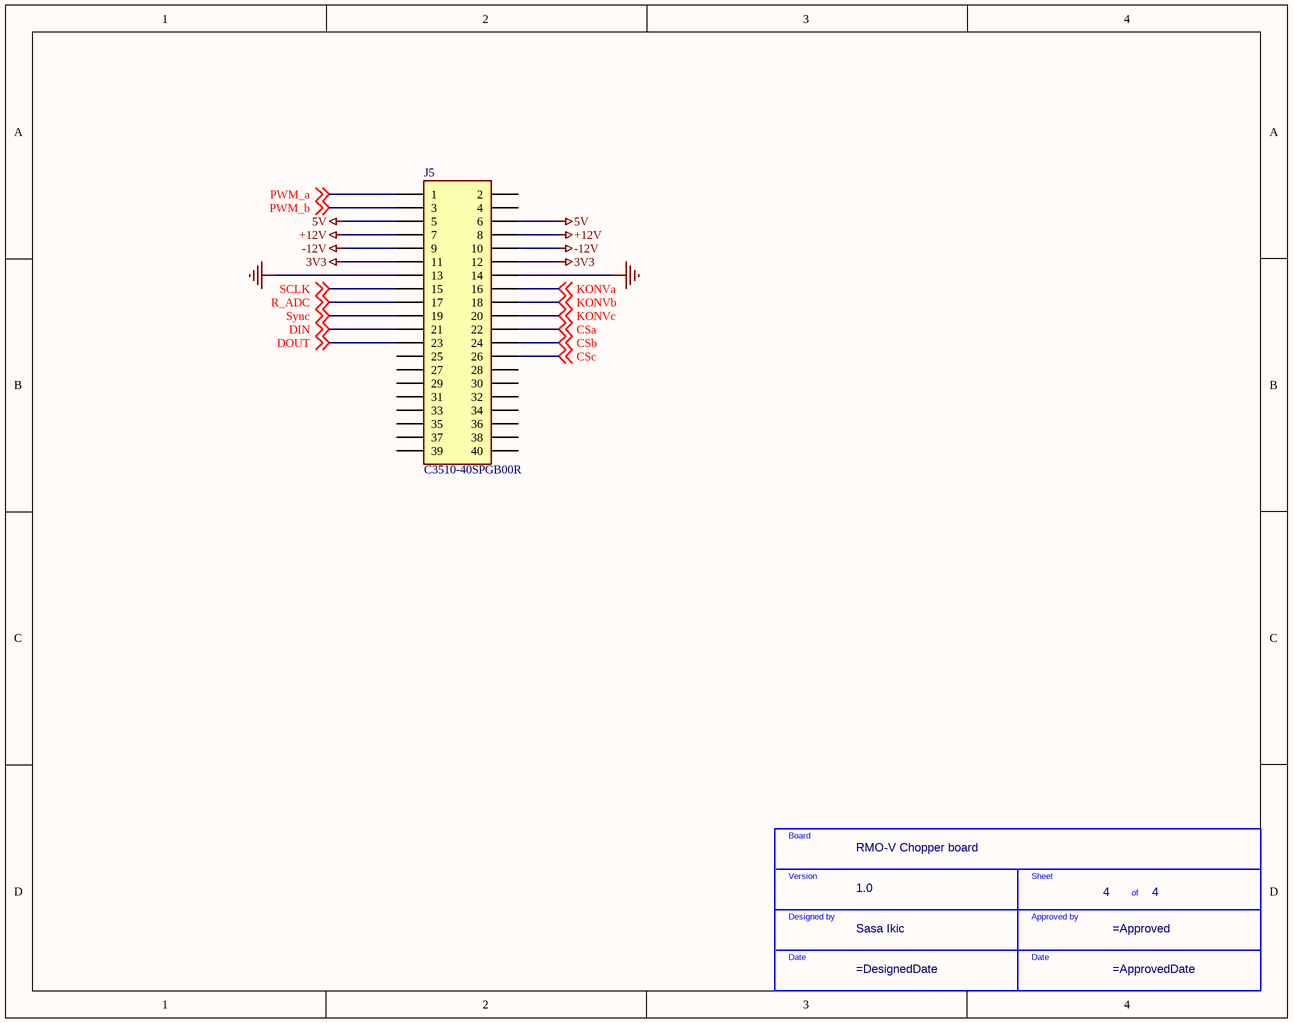
[diagram p4: 03-Connectors.SchDoc]

### Parts
(Parts that share a designator on the sheet are numbered #1, #2 ... from top to bottom, then left to right.)
J5  C3510-40SPGB00R  [CONN2X20_MOLEX]
STB#4  -  (value not drawn)  (graphical)

### Nets
3V3: J5.11 J5.12
5V: J5.5 J5.6
+12V: J5.7 J5.8
-12V: J5.9 J5.10
P_GND: J5.13 J5.14
CSa: J5.22 ; off-sheet CSa
CSb: J5.24 ; off-sheet CSb
CSc: J5.26 ; off-sheet CSc
DIN: J5.21 ; off-sheet DIN
DOUT: J5.23 ; off-sheet DOUT
KONVa: J5.16 ; off-sheet KONVa
KONVb: J5.18 ; off-sheet KONVb
KONVc: J5.20 ; off-sheet KONVc
PWM_a: J5.1 ; off-sheet PWM_a
PWM_b: J5.3 ; off-sheet PWM_b
R_ADC: J5.17 ; off-sheet R_ADC
SCLK: J5.15 ; off-sheet SCLK
Sync: J5.19 ; off-sheet Sync

Not connected (* = marked no-connect by the designer): J5 2 4 25 27 28 29 30 31 32 33 34 35 36 37 38 39 40

### Notes on the sheet
- (in symbol Schematic Title Block) Board; Version; Sheet; of; Designed by; Approved by; Date

### Library data of the parts
J5 = C3510-40SPGB00R: CONN2X20 IDC MALE; Manufacturer: Hsuan Mao Technology; Current Rating: 3A; Pitch: 2.54mm; Supplier 1: Elfa; Manufacturer Part Number: C3510-40SPGB00R; Stock 1: 2061; Pricing 1: 1 = 1.11000, 50 = 0.87000, 100 = 0.64000 (EUR); Contact Material: Gold; Housing Material: Thermoplastic; Contact Gender: Male; ComponentLink1URL: https://datasheet.ciiva.com/14156/04315503-14156870.pdf?src-supplier=Distrelec; ComponentLink1Description: Datasheet; Supplier Part Number 1: 14315560; Type: THT
STB#4 = Schematic Title Block: Schematic Title Block Template

## Nets that join several sheets
3V3: 01-PowerSupply (C34.2 L5.2 R44.2 ZD1.C), 02-MeasurementChannels (FB1.2), 03-Connectors (J5.11 J5.12)
5V: 01-PowerSupply (8 pins), 02-MeasurementChannels (FB2.2), 03-Connectors (J5.5 J5.6)
+12V: 00-Chopper-AB (6 pins), 01-PowerSupply (C23.1 C24.2 L3.2), 02-MeasurementChannels (FB4.2), 03-Connectors (J5.7 J5.8)
-12V: 01-PowerSupply (C25.1 C26.2 L4.2), 02-MeasurementChannels (FB3.2), 03-Connectors (J5.9 J5.10)
A_GND: 01-PowerSupply (6 pins), 02-MeasurementChannels (56 pins)
P_GND: 00-Chopper-AB (30 pins), 01-PowerSupply (13 pins), 02-MeasurementChannels (R65.2), 03-Connectors (J5.13 J5.14)
Vbat: 00-Chopper-AB (11 pins), 01-PowerSupply (C28.2 C29.2 U4.3)
CSa: 02-MeasurementChannels (R72.2 U10.4), 03-Connectors (J5.22)
CSb: 02-MeasurementChannels (R77.2 U11.4), 03-Connectors (J5.24)
CSc: 02-MeasurementChannels (R86.2 U12.4), 03-Connectors (J5.26)
DIN: 02-MeasurementChannels (U10.26 U11.26 U12.26), 03-Connectors (J5.21)
DOUT: 02-MeasurementChannels (U10.25 U11.25 U12.25), 03-Connectors (J5.23)
KONVa: 02-MeasurementChannels (R73.2 U10.24), 03-Connectors (J5.16)
KONVb: 02-MeasurementChannels (R78.2 U11.24), 03-Connectors (J5.18)
KONVc: 02-MeasurementChannels (R87.1 U12.24), 03-Connectors (J5.20)
PWM_a: 00-Chopper-AB (R14.2 R45.2 TP13.1 U1.5), 03-Connectors (J5.1)
PWM_b: 00-Chopper-AB (R46.1), 03-Connectors (J5.3)
R_ADC: 02-MeasurementChannels (U10.5 U11.5 U12.5), 03-Connectors (J5.17)
SCLK: 02-MeasurementChannels (6 pins), 03-Connectors (J5.15)
Shunt+: 00-Chopper-AB (R39.U1), 02-MeasurementChannels (C37.1 C40.1 LF1.2)
Shunt-: 00-Chopper-AB (R39.U2), 02-MeasurementChannels (C36.1 C37.2 LF1.1)
Sync: 02-MeasurementChannels (R74.1 R79.1 R88.1), 03-Connectors (J5.19)